# EAGLE design controller_A-rev.1 (EAGLE 7.6.0)
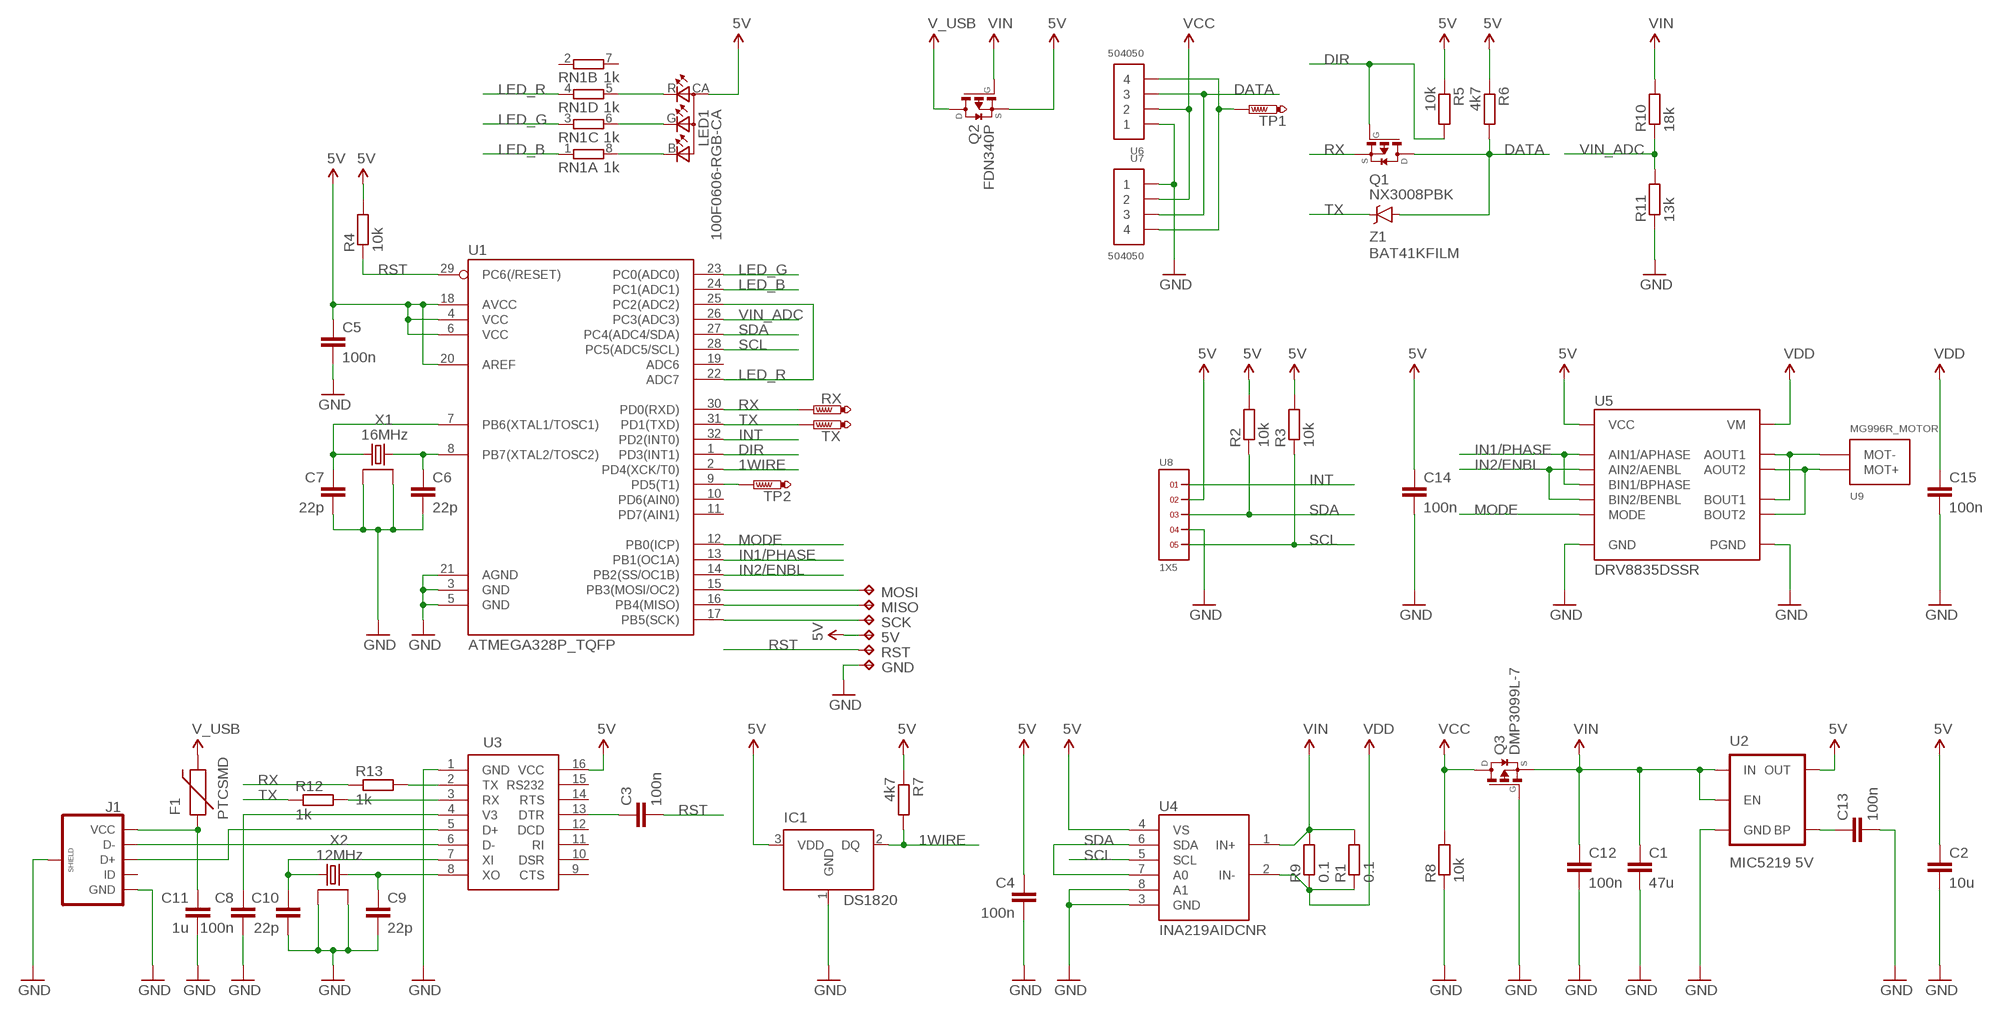
[diagram p0: schematic, sheet 1]

## Parts
5V  TPTP07SQ  [TP07SQ]
C1  47u  C-EUC1206  [C1206]
C2  10u  C-EUC0603K  [C0603K]
C3  100n  C-EUC0402K  [C0402K]
C4  100n  C-EUC0402K  [C0402K]
C5  100n  C-EUC0402K  [C0402K]
C6  22p  C-EUC0402K  [C0402K]
C7  22p  C-EUC0402K  [C0402K]
C8  100n  C-EUC0402K  [C0402K]
C9  22p  C-EUC0402K  [C0402K]
C10  22p  C-EUC0402K  [C0402K]
C11  1u  C-EUC0402K  [C0402K]
C12  100n  C-EUC0402K  [C0402K]
C13  100n  C-EUC0402K  [C0402K]
C14  100n  C-EUC0402K  [C0402K]
C15  100n  C-EUC0402K  [C0402K]
F1  PTCSMD  [PTC-1206]
GND  TPTP07SQ  [TP07SQ]
IC1  DS1820  [TO-92]
J1  USB_MICROB_PLUGCONN-11752  [USB-B-MICRO-SMD_V03]
LED1  100F0606-RGB-CA  [1616]
MISO  TPTP07SQ  [TP07SQ]
MOSI  TPTP07SQ  [TP07SQ]
Q1  NX3008PBK  FDN340P  [SSOT-3]
Q2  FDN340P  [SSOT-3]
Q3  DMP3099L-7  SI2333DS  [SOT23]
R1  0.1  R-EU_R0603  [R0603]
R2  10k  R-EU_R0402  [R0402]
R3  10k  R-EU_R0402  [R0402]
R4  10k  R-EU_R0402  [R0402]
R5  10k  R-EU_R0402  [R0402]
R6  4k7  R-EU_R0402  [R0402]
R7  4k7  R-EU_R0402  [R0402]
R8  10k  R-EU_R0402  [R0402]
R9  0.1  R-EU_R2512  [R2512]
R10  18k  R-EU_R0402  [R0402]
R11  13k  R-EU_R0402  [R0402]
R12  1k  R-EU_R0402  [R0402]
R13  1k  R-EU_R0402  [R0402]
RN1  1k  4R-NYC124  [YC124]
RST  TPTP07SQ  [TP07SQ]
RX  PTR1TP10R  [TP10R]
SCK  TPTP07SQ  [TP07SQ]
TP1  PTR1TP10R  [TP10R]
TP2  PTR1TP10R  [TP10R]
TX  PTR1TP10R  [TP10R]
U1  ATMEGA328P_TQFP  [TQFP32-08]
U2  MIC5219 5V  V_REG_MIC52195V  [SOT23-5]
U3  CH340G  [SOIC16]
U4  INA219AIDCNR  [SOT23-8L]
U5  DRV8835DSSR  [WSON-12]
U6  504050  [504050]
U7  504050  [504050]
U8  1X5  [1X5]
U9  MG996R_MOTOR  [MOTOR]
X1  16MHz  GSX-331  [OSC3225]
X2  12MHz  GSX-331  [OSC3225]
Z1  BAT41KFILM  [SOD-523]

## Nets
1WIRE: IC1.2(DQ) R7.2 U1.2(PD4(XCK/T0))
5V: 5V.TP C2.1 C4.1 C5.1 C14.1 IC1.3(VDD) LED1.CA Q2.2(S) R2.2 R3.2 R4.2 R5.1 R6.1 R7.1 U1.4(VCC) U1.6(VCC) U1.18(AVCC) U1.20(AREF) U2.5(OUT) U3.16(VCC) U4.4(VS) U5.P$12(VCC) U8.2
AUX: TP1.TP U6.P$4 U7.P$4
D+: J1.D+ U3.5(D+)
D-: J1.D- U3.6(D-)
DATA: Q1.3(D) R6.2 U6.P$3 U7.P$3 Z1.P$1
DIR: Q1.1(G) R5.2 U1.1(PD3(INT1))
GND: C1.2 C2.2 C4.2 C5.2 C6.2 C7.2 C8.2 C9.2 C10.2 C11.2 C12.2 C13.2 C14.2 C15.2 GND.TP IC1.1(GND) J1.GND J1.SHIELD1(SHIELD) J1.SHIELD2(SHIELD) J1.SHIELD3(SHIELD) Q3.1(G) R8.1 R11.1 U1.3(GND) U1.5(GND) U1.21(AGND) U2.2(GND) U3.1(GND) U4.3(GND) U4.8(A1) U5.P$6(GND) U5.P$13(PGND) U5.P$14(PGND) U5.P$15(PGND) U5.P$16(PGND) U6.P$1 U7.P$1 U8.4 X1.P$2 X1.P$4 X2.P$2 X2.P$4
IN1/PHASE: U1.13(PB1(OC1A)) U5.P$8(BIN1/BPHASE) U5.P$10(AIN1/APHASE)
IN2/ENBL: U1.14(PB2(SS/OC1B)) U5.P$7(BIN2/BENBL) U5.P$9(AIN2/AENBL)
INT: U1.32(PD2(INT0)) U8.1
LED_B: RN1.1 U1.24(PC1(ADC1))
LED_B_: LED1.B RN1.8
LED_G: RN1.3 U1.23(PC0(ADC0))
LED_G_: LED1.G RN1.6
LED_R: RN1.4 U1.22(ADC7) U1.25(PC2(ADC2))
LED_R_: LED1.R RN1.5
MODE: U1.12(PB0(ICP)) U5.P$11(MODE)
MOT+: U5.P$2(AOUT1) U5.P$4(BOUT1) U9.P$3(MOT-) U9.P$4(MOT-)
MOT-: U5.P$3(AOUT2) U5.P$5(BOUT2) U9.P$1(MOT+) U9.P$2(MOT+)
N$1: C6.1 U1.8(PB7(XTAL2/TOSC2)) X1.P$1
N$2: C7.1 U1.7(PB6(XTAL1/TOSC1)) X1.P$3
N$3: MOSI.TP U1.15(PB3(MOSI/OC2))
N$4: MISO.TP U1.16(PB4(MISO))
N$5: C3.1 U3.13(DTR)
N$6: R13.2 U3.2(TX)
N$8: C10.1 U3.7(XI) X2.P$3
N$9: C9.1 U3.8(XO) X2.P$1
N$10: C11.1 F1.1 J1.VBUS(VCC)
N$11: C8.1 U3.4(V3)
N$12: C13.1 U2.4(BP)
N$13: TP2.TP U1.9(PD5(T1))
N$14: SCK.TP U1.17(PB5(SCK))
N$15: R12.2 U3.3(RX)
RST: C3.2 R4.1 RST.TP U1.29(PC6(/RESET))
RX: Q1.2(S) R13.1 RX.TP U1.30(PD0(RXD))
SCL: R3.1 U1.28(PC5(ADC5/SCL)) U4.5(SCL) U8.5
SDA: R2.1 U1.27(PC4(ADC4/SDA)) U4.6(SDA) U4.7(A0) U8.3
TX: R12.1 TX.TP U1.31(PD1(TXD)) Z1.P$2
V_USB: F1.2 Q2.3(D)
VCC: Q3.3(D) R8.2 U6.P$2 U7.P$2
VDD: C15.1 R1.1 R9.1 U4.2(IN-) U5.P$1(VM)
VIN: C1.1 C12.1 Q2.1(G) Q3.2(S) R1.2 R9.2 R10.2 U2.1(IN) U2.3(EN) U4.1(IN+)
VIN_ADC: R10.1 R11.2 U1.26(PC3(ADC3))
Unconnected: J1.ID RN1.2 RN1.7 U1.10(PD6(AIN0)) U1.11(PD7(AIN1)) U1.19(ADC6) U3.9(CTS) U3.10(DSR) U3.11(RI) U3.12(DCD) U3.14(RTS) U3.15(RS232)

## Library data of the parts
5V GND MISO MOSI RST SCK = testpad:TP: Test pad
C1-C15 = rcl:C-EU: CAPACITOR, European symbol
F1 = SparkFun-PowerIC:PTC: Resettable Fuse PTC Resettable Fuse. Spark Fun Electronics SKU : COM-08357; PROD_ID: RES-11150
IC1 = DS1820:DS1820: DS1820 - 1-Wire Digital Thermometer
J1 = ch340g:USB_MICROB_PLUG: USB Micro-B connectors Some male, some female. Watch your step!; PROD_ID: CONN-11752
LED1 = 100F0606-RGB-CA:100F0606-RGB-CA: Common-anode 1616 RGB LED
Q1 Q2 = transistor-fet:FDN340P: P-Channel MOSFET Logic Level, PowerTrench MOSFET
Q3 = transistor-fet:SI2333DS: P-Channel MOSFET
R1-R13 = rcl:R-EU_: RESISTOR, European symbol
RN1 = resistor-dil:4R-N: Array Chip Resistor Source: RS Component / Phycomp; OC_FARNELL: unknown; OC_NEWARK: unknown
RX TP1 TP2 TX = testpad:PTR1: TEST PIN
U1 = SparkFun-DigitalIC:ATMEGA328P_TQFP; PROD_ID: IC-09069
U2 = SparkFun-PowerIC:V_REG_MIC5219: V_REG MIC5219 Standard 3.3V and 5V 500mA LDO voltage regulator in SOT-23 layout. Micrel part MIC5219. BP (by-pass) pin is used to lower output noise with 470pF cap, may be left open.; PROD_ID: VREG-10107
U3 = ch340g:CH340G
U4 = INA219AIDCNR:INA219AIDCNR
U5 = DRV8835:DRV8835DSSR
U6 U7 = con-molex-picolock:504050
U8 = headers(.05in):1X5
U9 = MG996R-Motor:MG996R_MOTOR
X1 X2 = crystals_golledge_full_v1-0:GSX-331: Crystal |SM| 3.2 x 2.5 mm | AT cut | Frequency Range 10 - 125 MHz Metal lid can be grounded to minimise EMI Seam sealed for excellent long-term stability Tight specifications available Ultra-miniature for maximum space saving Datasheet <http://www.golledge.com/docs/products/xtl_sm/gsx331.htm?src=eagle>; HEIGHT: 0.8
Z1 = schottky:BAT41KFILM: 100V, 200mA Schottky barrier diode SOD-523 package 3pF

## Board
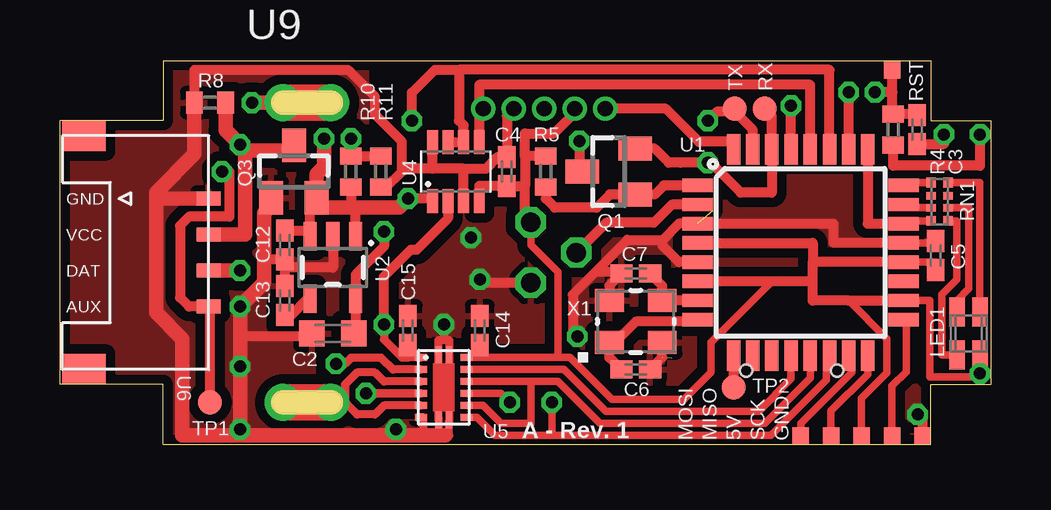
[diagram p1: board, top side]
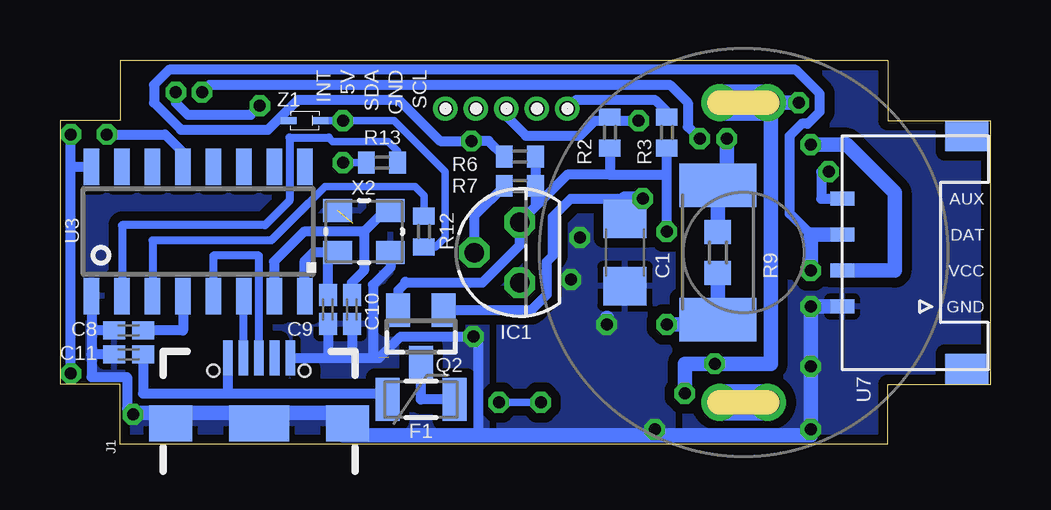
[diagram p2: board, bottom side, seen from below]

Size 38.8 x 16 mm. Coordinates in mm from the lower left corner, seen from the top.
Outline: 4.3,16 36.3,16 36.3,13.5 38.8,13.5 38.8,2.5 36.3,2.5 36.3,0 4.3,0 4.3,2.5 1.8,2.5 0,2.5 0,13.5 1.8,13.5 4.3,13.5 4.3,16
Copper layers (1*16): Top 0.0356mm / dielectric 1.5011mm / Bottom 0.0356mm
Design rules "OSHPark-2layer": minimum track width 6mil, minimum drill 13mil, track to track 6mil, track to pad 6mil, pad to pad 6mil, via to via 6mil, smd to smd 6mil, copper to edge 15mil, drill to drill 6mil, minimum pad ring 7mil, minimum via ring 7mil, stop-mask expansion 2.5mil, vias tented up to drill 0mil, thermal gap 10mil

### Footprints (pad centres in the part's own frame; a part is rotated, then mirrored left to right if it is on the bottom)
TP07SQ = smd 0.7 x 0.7: TP 0,0
C1206 = smd 1.6 x 1.8: 1 -1.4,0; 2 1.4,0
C0603K = smd 1.05 x 1.08: 1 -0.875,0; 2 0.875,0
C0402K = smd 0.925 x 0.74: 1 -0.6,0; 2 0.6,0
PTC-1206 = smd 1 x 1.8: 1 -1.4,0; 2 1.4,0
TO-92 = drill 0.813 pad 1.27 octagon: 1 -1.27,0; 2 0,1.905; 3 1.27,0
USB-B-MICRO-SMD_V03 = smd 1.45 x 0.4: D+ 2.725,0; D- 2.725,0.65; GND 2.725,-1.3; ID 2.725,-0.65; VBUS 2.725,1.3 | smd 1.5 x 1.8: SHIELD1 0,3.685; SHIELD2 0,-3.685 | smd 1.5 x 2.5: SHIELD3 0,0 | hole 0.5: 2.2,1.9; 2.2,-1.9
1616 = smd 0.65 x 1.2: B -0.475,-0.9; CA -0.475,0.9; G 0.475,-0.9; R 0.475,0.9
SSOT-3 = smd 1 x 1.4: 1 -0.95,-1.1; 2 0.95,-1.1; 3 0,1.1
SOT23 = smd 1 x 1.4: 1 -0.95,-1.1; 2 0.95,-1.1; 3 0,1.1
R0603 = smd 1 x 1.1: 1 -0.85,0; 2 0.85,0
R0402 = smd 0.7 x 0.9: 1 -0.65,0; 2 0.65,0
R2512 = smd 1.8 x 3.2: 1 -2.8,0; 2 2.8,0
YC124 = smd 0.4 x 0.4: 1 -0.8,-0.35; 4 0.8,-0.35; 5 0.8,0.35; 8 -0.8,0.35 | smd 0.3 x 0.4: 2 -0.25,-0.35; 3 0.25,-0.35; 6 0.25,0.35; 7 -0.25,0.35
TP10R = smd 1 x 1: TP 0,0
TQFP32-08 = smd 1.27 x 0.559: 1 -4.293,2.8; 2 -4.293,2; 3 -4.293,1.2; 4 -4.293,0.4; 5 -4.293,-0.4; 6 -4.293,-1.2; 7 -4.293,-2; 8 -4.293,-2.8; 17 4.293,-2.8; 18 4.293,-2; 19 4.293,-1.2; 20 4.293,-0.4; 21 4.293,0.4; 22 4.293,1.2; 23 4.293,2; 24 4.293,2.8 | smd 0.559 x 1.27: 9 -2.8,-4.293; 10 -2,-4.293; 11 -1.2,-4.293; 12 -0.4,-4.293; 13 0.4,-4.293; 14 1.2,-4.293; 15 2,-4.293; 16 2.8,-4.293; 25 2.8,4.293; 26 2,4.293; 27 1.2,4.293; 28 0.4,4.293; 29 -0.4,4.293; 30 -1.2,4.293; 31 -2,4.293; 32 -2.8,4.293
SOT23-5 = smd 0.55 x 1.2: 1 -0.95,-1.3; 2 0,-1.3; 3 0.95,-1.3; 4 0.95,1.3; 5 -0.95,1.3
SOIC16 = smd 0.635 x 1.524: 1 -4.445,-2.695; 2 -3.175,-2.695; 3 -1.905,-2.695; 4 -0.635,-2.695; 5 0.635,-2.695; 6 1.905,-2.695; 7 3.175,-2.695; 8 4.445,-2.695; 9 4.445,2.695; 10 3.175,2.695; 11 1.905,2.695; 12 0.635,2.695; 13 -0.635,2.695; 14 -1.905,2.695; 15 -3.175,2.695; 16 -4.445,2.695
SOT23-8L = smd 0.45 x 1: 1 -0.975,-1.225; 2 -0.325,-1.225; 3 0.325,-1.225; 4 0.975,-1.225; 5 0.975,1.225; 6 0.325,1.225; 7 -0.325,1.225; 8 -0.975,1.225
WSON-12 = smd 0.28 x 0.5: P$1 -1.25,-0.95; P$2 -0.75,-0.95; P$3 -0.25,-0.95; P$4 0.25,-0.95; P$5 0.75,-0.95; P$6 1.25,-0.95; P$7 1.25,0.95; P$8 0.75,0.95; P$9 0.25,0.95; P$10 -0.25,0.95; P$11 -0.75,0.95; P$12 -1.25,0.95 | smd 0.7 x 0.25: P$13 -1.35,0.225; P$14 -1.35,-0.225; P$15 1.35,-0.225; P$16 1.35,0.225
504050 = smd 0.6 x 1: P$1 2.25,0.01; P$2 0.75,0.01; P$3 -0.75,0.01; P$4 -2.25,0.01 | smd 1.25 x 1.8: P$5 4.855,5.2; P$6 -4.855,5.2
1X5 = drill 0.635 pad 1.016: 1 0,0; 2 1.27,0; 3 2.54,0; 4 3.81,0; 5 5.08,0
MOTOR = drill 1.016: P$1 1,-6.25; P$2 -1,-6.25; P$3 1,6.25; P$4 -1,6.25
OSC3225 = smd 1.2 x 0.95: P$1 -1.1,-0.875; P$2 1.1,-0.875; P$3 1.1,0.875; P$4 -1.1,0.875
SOD-523 = smd 0.65 x 0.3: P$1 0.675,0; P$2 -0.675,0

### Placement (x,y rotation side)
5V  33.41,0.35 90 top
C1  15.25,8 270 bottom
C2  11.38,4.62 180 top
C3  35.73,13.12 90 top
C4  18.62,11.38 90 top
C5  36.5,7.88 90 top
C6  24,3.12 0 top
C7  24,7.12 180 top
C8  35.94,4.75 180 bottom
C9  27.62,5.62 270 bottom
C10  26.62,5.62 270 bottom
C11  35.94,3.75 180 bottom
C12  9.38,8.31 270 top
C13  9.38,6 90 top
C14  17.5,4.75 90 top
C15  14.5,4.75 90 top
F1  23.75,1.88 0 bottom
GND  35.95,0.35 0 top
IC1  19.62,8 90 bottom
J1  30.5,0.88 90 bottom
LED1  37.88,4.62 180 top
MISO  32.15,0.35 90 top
MOSI  30.88,0.35 90 top
Q1  22.88,11.38 90 top
Q2  23.75,4.5 180 bottom
Q3  9.75,11.38 0 top
R1  11.38,8 90 bottom
R2  15.88,13 270 bottom
R3  13.5,13 270 bottom
R4  34.73,13.12 270 top
R5  20.25,11.38 270 top
R6  19.62,12 180 bottom
R7  19.62,10.78 180 bottom
R8  6.25,14.25 0 top
R9  11.38,8 90 bottom
R10  12.12,11.38 270 top
R11  13.38,11.38 90 top
R12  23.62,8.88 90 bottom
R13  25.38,11.75 0 bottom
RN1  36.66,10.12 270 top
RST  34.69,15.6 90 top
RX  29.38,14 0 top
SCK  34.69,0.35 90 top
TP1  6.25,1.75 0 top
TP2  28.07,2.38 0 top
TX  28.12,14 0 top
U1  30.88,8 0 top
U2  11.38,7.38 180 top
U3  33.04,8.88 0 bottom
U4  16.5,11.38 0 top
U5  16,2.38 270 top
U6  6.2,8 90 top
U7  6.2,8 270 bottom
U8  22.73,14 0 bottom
U9  10.3,8 0 top
X1  24,5.12 0 top
X2  26.12,8.88 0 bottom
Z1  28.59,13.5 180 bottom

### Tracks (layer width: path | path; a pad name or v marks a point on that pad's centre or on a via)
1WIRE
  Top 0.406: U1.2 25.5,10 24.75,9.25 22.78,9.25 IC1.2
  Bottom 0.406: R7.2 21.53,9.52 IC1.2
5V  (via drill 0.5)
  Top 0.305: 20.75,3.62 21.25,3.62 23,1.88 26,1.88 27.12,3 27.12,4.25 29.62,6.75 29.62,6.8 | 20.75,3.62 17.5,3.62 | 17.5,3.62 U5.P$12 | C14.1 17.5,3.62 | 5V.TP 33.41,1.92 34.48,2.98 34.48,4.4 32.88,6 | U1.20 36.5,7.6 C5.1 | U1.18 36.25,6 36.25,2.81 38.2,2.81 v38.34,2.96 LED1.CA | IC1.3 19.62,8.31 20.75,7.19 20.75,3.62
  Top 0.406: C2.1 12.32,4.62 U2.5 12.32,7.08 13.5,8.25 v13.5,8.88 | 19.38,10.78 C4.1 17.48,10.78 U4.4 | v38.34,12.92 38.34,11.62 34.73,11.62 R4.2 | IC1.3 19.38,9.52 19.38,10.78 | U1.4 31.38,8.4 31.38,7.6 | U1.20 31.38,7.6 | 31.38,6.8 31.38,6 32.88,6 U1.18 | 31.38,6.8 31.38,7.6 | 31.38,6.8 29.62,6.8 U1.6 | U8.2 21.46,13.84 20.59,12.96 19.38,12.96 19.38,12.03 | R5.1 19.38,12.03 | 19.38,12.03 19.38,10.78
  Bottom 0.406: v13.5,8.88 13.5,11.25 | 13.5,11.25 R3.2 | 19.64,9.25 IC1.3 | v38.34,2.96 38.34,11.57 | 38.34,11.57 v38.34,12.92 | Q2.2 24.7,6.42 24.38,6.75 | U3.16 38.34,11.57 | 24.38,6.75 21.19,6.75 19.62,8.31 IC1.3 | 24.4,6.78 24.38,6.75 | 15.88,11.25 13.5,11.25 | R2.2 15.88,11.25 | 15.88,11.25 17.64,11.25 IC1.3 | IC1.3 18.98,9.92 R7.1 R6.1
AUX  (via drill 0.5)
  Top 0.406: v6.75,11.38 7.06,11.38 7.06,9.5 5.38,9.5 5,9.12 5,6.12 5.38,5.75 U6.P$4 6.25,5.75 TP1.TP
  Bottom 0.406: v6.75,11.38 7.06,11.38 7.06,10.25 U7.P$4
D+
  Bottom 0.33: J1.D+ 30.5,7.88 32.41,7.88 U3.5
D-
  Bottom 0.33: J1.D- 31.15,5.68
  Bottom 0.406: 31.15,5.68 U3.6
DATA  (via drill 0.5)
  Top 0.406: v21.65,12.65 21.65,11.38 Q1.3
  Top 0.61: v7.5,7.25 U6.P$3
  Bottom 0.305: Z1.P$1 29.75,13.5 30,13.25
  Bottom 0.406: 7.5,8.75 8.38,9.62 8.38,12.88 7.88,13.38 7.62,13.38 7.12,13.88 7.12,14.62 8.12,15.62 34.25,15.62 34.88,15 34.88,14.25 33.75,13.12 30.12,13.12 30,13.25 28.88,14.38 24.68,14.38 22.95,12.65 v21.65,12.65 20.93,12.65 R6.2
  Bottom 0.61: U7.P$3 7.5,8.75 v7.5,7.25 7.62,7.25
DIR
  Top 0.406: U1.1 25.18,10.8 24.8,10.43 Q1.1 22.93,10.43 22.38,9.88 20.62,9.88 20.25,10.25 R5.2
GND  (via drill 0.5)  (2 unrouted)
  Top 0.305: 15.78,0.38 16.06,0.38 16.23,0.38 | U1.21 36.5,8.4 C5.2
  Top 0.34: U5.P$15 U5.P$14 15.78,4.35 16,4.35 | U5.P$16 U5.P$13 16.23,4.35 16,4.35 | 16,4.35 v16,5 | U5.P$15 15.78,0.38 | 16.23,0.38 16.23,1 | 15.78,1.12 U5.P$15 | 15.12,1.12 15.12,0.38
  Top 0.35: U5.P$6 15.12,1.12
  Top 0.406: R8.1 5.6,15.62 12,15.62 13.12,14.5 13.12,13.75 14.25,12.62 14.25,11.5 | U4.3 16.82,11.5 | 16.82,11.5 17.75,11.5 18.23,11.97 C4.2 18.62,13.71 U8.4 | U2.2 11.38,7.38 9.38,7.38 C12.2 | C13.2 C12.2 | C2.2 10.5,4.5 7.5,4.5 v7.5,3.25 | v35.75,1.25 35.95,1.25 GND.TP | C12.2 8.5,7.71 | 16.82,11.5 15.53,11.5 | 15.53,11.5 U4.8 | 15.53,11.5 14.25,11.5 | U1.21 32.25,8.4 32.25,9.2 U1.3 25.8,9.2 25.12,8.53 | R11.1 13.6,10.72 14.25,11.38 14.25,11.5 | 22.31,7.19 23.65,8.53 25.12,8.53 | 22.31,7.19 21.38,6.25 21.38,4.5 v21.56,4.5 | U1.5 25.8,7.6 25.12,8.28 25.12,8.53 | 22.31,7.19 23.34,7.19 C7.2 22.9,6.62 X1.P$4 | C6.2 25.1,3.62 X1.P$2 | IC1.1 17.5,6.73 v17.5,6.88
  Top 0.61: 4,10.25 4,5.5 5.1,4.4 5.1,0.38 7.5,0.38 | Q3.1 8.8,9.95 8.5,9.65 8.5,7.71 8.5,6.75 v7.5,5.75 v7.5,3.25 7.5,0.38 | 7.5,0.38 15.12,0.38 16.06,0.38 | U6.P$1 4,10.25 | 4,10.25 4,10.5 5.6,12.1 R8.1
  Bottom 0.406: 21.38,0.38 21.38,4.5 v21.56,4.5 24.6,4.5 25.5,3.6 25.75,3.6 | U3.1 37.48,4.75 | 37.48,3.75 37.48,2.81 36,2.81 36,1.5 v35.75,1.25 | J1.GND 27.62,3.6 | 27.62,3.6 26.62,3.6 | 26.62,3.6 25.75,3.6 | C8.2 37.48,4.75 | 37.48,4.75 37.48,3.75 | C11.2 37.48,3.75 | 25.75,3.6 25.75,6.65 25.02,7.38 X2.P$2 | C10.2 26.62,3.6 | C9.2 27.62,3.6
  Bottom 0.61: U7.P$1 v7.5,5.75 v7.5,3.25 v7.5,0.62 7.5,0.38 21.38,0.38 27,0.38 26.94,0.43 J1.SHIELD2 26.82,1.32 30.5,1.32 | 16,5.28 v16,5 | 30.5,1.32 34.25,1.32 | 34.25,1.32 35.75,1.32 v35.75,1.25 | J1.SHIELD3 30.5,1.32 | J1.SHIELD1 34.25,0.88 34.25,1.32
  other vias: 17.12,8.62 14,0.62
  pour Bottom (isolate 0.406): 13.25,0 13.25,10 20.5,10 20.5,0
  pour Top (isolate 0.406): 13.25,10 13.25,0 20.5,0 20.5,10
  pour Top (isolate 0.406): 0,16 12.75,16 12.75,0 0,0
  pour Bottom (isolate 0.406): 12.75,0 0,0 0,16 12.75,16
  pour Bottom (isolate 0.406): 21,0 21,16 38.8,16 38.8,0
  pour Top (isolate 0.406): 21,0 38.8,0 38.8,16 21,16
IN1/PHASE
  Top 0.305: U5.P$10 19.62,2.62 | 19.62,2.62 20.75,2.62 22.5,0.88 29.38,0.88 31.27,2.77 U1.13 | U5.P$8 17.62,1.62 18.38,0.88 19.62,0.88 19.62,2.62
IN2/ENBL  (via drill 0.5)
  Top 0.305: U5.P$9 18.38,2.12 v18.75,1.75 | U5.P$7 17.38,1.12 18.12,0.38 20.5,0.38 | v20.5,1.75 20.5,0.38 | 20.5,0.38 29.62,0.38 31.95,2.7 31.95,3.71 U1.14
  Bottom 0.305: v18.75,1.75 v20.5,1.75
INT
  Top 0.406: U1.32 28.07,12.62 26.62,12.62 25.25,14 U8.1
LED_B
  Top 0.305: U1.24 35.17,10.91 RN1.1
LED_B_
  Top 0.305: LED1.B 38.35,10.91 RN1.8
LED_G
  Top 0.305: U1.23 35.17,9.87 RN1.3
LED_G_
  Top 0.305: LED1.G 37.4,6 37.88,6.5 37.88,9.87 RN1.6
LED_R
  Top 0.305: U1.22 35.17,9.31 RN1.4
  Top 0.406: U1.25 33.67,9.2 U1.22
LED_R_
  Top 0.305: LED1.R 36.75,3.73 36.75,6.25 37.38,6.88 37.38,9.31 RN1.5
MODE
  Top 0.305: U5.P$11 21,3.12 22.75,1.38 29.12,1.38 30.48,2.73 U1.12
MOT+  (via drill 0.5)
  Top 0.34: U5.P$2 13.88,3.12 13.39,3.61 12.12,3.61 11.88,3.36 v11.5,3.36
  Top 0.35: U5.P$4 v12.75,2.12
  Top 0.61: v8,14.25 U9.P$4
  Bottom 0.61: v12.75,2.12 12.75,3.36 v11.5,3.36 9.18,3.36 9.18,14.25 | 9.18,14.25 U9.P$3 | 9.18,14.25 v8,14.25
MOT-
  Top 0.34: U5.P$3 13.5,2.62 13.12,3 12.38,3 11.88,2.5 11.88,1.75 12.38,1.25 13.12,1.25 13.5,1.62 U5.P$5
  Top 0.35: 11.88,1.75 U9.P$1
N$1
  Top 0.406: U1.8 26.51,5.12 24,5.12 23.12,4.25 X1.P$1 22.9,3.62 C6.1
N$2
  Top 0.406: U1.7 X1.P$3 25.1,6.62 C7.1
N$3
  Top 0.305: MOSI.TP 30.88,0.87 33,3 33,3.71 U1.15
N$4
  Top 0.305: U1.16 33.67,2.92 32.15,1.4 MISO.TP
N$5  (via drill 0.5)
  Top 0.406: C3.1 36.85,12.53 v36.85,12.92
  Bottom 0.406: 33.67,11.8 U3.13 33.67,12.18 34.42,12.92 v36.85,12.92
N$6
  Bottom 0.305: 27.6,12.79 27.43,12.62 25.12,12.62 24.73,12.22 R13.2
  Bottom 0.33: U3.2 36.22,9.14 30.25,9.14 29.23,10.16 29.23,12.79 27.6,12.79
N$8
  Bottom 0.406: X2.P$3 25.25,9.75 26.12,8.88 | 26.12,8.88 28.62,8.88 29.88,7.62 29.88,6.19 U3.7 | 26.12,8.88 26.12,7.25 26.62,6.75 C10.1
N$9
  Bottom 0.406: U3.8 28.59,7.66 28.25,8 X2.P$1 27.62,7.6 C9.1
N$10
  Bottom 0.406: 31.8,2.12 35.34,2.12 C11.1 | 31.8,2.12 25.15,2.12 F1.1 | 31.8,4.12 J1.VBUS 31.8,2.12
N$11
  Bottom 0.406: U3.4 33.67,4.75 C8.1
N$12
  Top 0.406: C13.1 9.65,5.4 10.32,6.08 U2.4
N$13
  Top 0.406: U1.9 TP2.TP
N$14
  Top 0.305: SCK.TP 34.69,2.44 35.27,3.02 35.27,5.2 U1.17
N$15
  Bottom 0.305: 28.44,10.06 27.75,10.75 24,10.75 23.62,10.38 R12.2
  Bottom 0.33: U3.3 34.95,8.51 29.99,8.51 28.44,10.06
RST  (via drill 0.5)
  Top 0.406: U1.29 v30.48,14.12 | C3.2 35.73,13.78 R4.1 34.7,13.78 34.7,14.69 | 34.7,14.69 v33.98,14.69 | 34.7,14.69 RST.TP
  Bottom 0.406: v33.98,14.69 33.98,14.25 33.48,13.75 30.85,13.75 v30.48,14.12
RX  (via drill 0.5)
  Top 0.406: v27,11.75 25.88,11.75 | v27,11.75 25.38,11.75 24.8,12.32 Q1.2 | v27,11.75 27.12,11.75 28.38,10.5 29.68,10.5 U1.30 29.68,13.7 RX.TP
  Bottom 0.305: v27,11.75 R13.1
SCL
  Top 0.406: U1.28 31.27,15 17.48,15 17.48,14 | 17.48,14 U4.5 | U8.5 17.48,14
  Bottom 0.406: R3.1 13.5,13.88 14,14.38 17.27,14.38 U8.5
SDA  (via drill 0.5)
  Top 0.406: U1.27 32.08,15.62 16.62,15.62 | 16.62,15.62 16.62,13.5 16.82,13.3 U4.6 U4.7 | v14.68,13.5 14.68,14.68 15.62,15.62 16.62,15.62
  Bottom 0.406: 15.88,13.5 16.5,13.5 17.12,12.88 19.38,12.88 20.19,13.69 U8.3 | 15.88,13.5 v14.68,13.5 | R2.1 15.88,13.5
TX  (via drill 0.5)
  Top 0.406: v27,13.5 27.38,13.88 28,13.88 TX.TP 28.12,13.88 28.88,13.12 U1.31
  Bottom 0.305: Z1.P$2 v27,13.5 24.88,13.5 22.75,11.38 22.75,8.62 23.15,8.22 R12.1
V_USB
  Bottom 0.406: F1.2 23.75,1.88 Q2.3
VCC  (via drill 0.5)
  Top 0.61: U6.P$2 7.72,8.75 7.72,12.25 | R8.2 6.9,13.1 v7.5,12.5 7.72,12.28 7.72,12.25 | 7.72,12.25 9.75,12.25 Q3.3
  Bottom 0.61: U7.P$2 4,7.25 4,10.5 6,12.5 v7.5,12.5
VDD  (via drill 0.5)
  Top 0.34: U5.P$1 14.5,3.62 | 14.25,3.62 13.5,4.38 v13.5,5
  Top 0.35: 14.25,3.62 14.5,3.62 C15.1
  Top 0.406: v13.5,5 13.5,7 14.62,8.12 14.88,8.12 16.18,9.43 U4.2
  Bottom 0.61: v13.5,5 11.38,5 R9.1 R1.1
VIN  (via drill 0.5)
  Top 0.406: U4.1 15.53,10.25 v14.5,10.25 | R10.2 12.12,9.88 11.75,9.88 10.43,9.88 10.43,8.91 | U2.1 12.32,9.88 12.25,9.88 | U2.3 10.43,8.91 | C12.1 10.43,8.91
  Top 0.61: v11,12.75 11,11.57 10.7,11.28 Q3.2 | 10.7,10.05 Q3.2 | v14.5,10.25 14.12,9.88 12.25,9.88 11.75,9.88 10.7,9.88 Q3.2
  Bottom 0.406: 15.25,10.25 17.5,10.25 18.25,9.5 18.25,7.88 18.5,7.62 18.5,6.25 19.15,5.6 Q2.1
  Bottom 0.61: v11,12.75 11,11.43 R9.2 R1.2 | v14.5,10.25 15.25,10.25 C1.1
VIN_ADC  (via drill 0.5)
  Top 0.406: U1.26 v32.88,14.69 | R11.2 R10.1 v12.12,12.75
  Bottom 0.406: v12.12,12.75 12.62,13.25 12.62,14.25 13.38,15 32.56,15 v32.88,14.69

### Text on the board
tNames: GND | VCC | DAT | AUX | A - Rev. 1
bNames: SCL | GND | SDA | 5V | INT | AUX | DAT | VCC | GND
tDocu: TOP